# Altium schematic sheet CH565W-R0-1v1.SchDoc
size A1
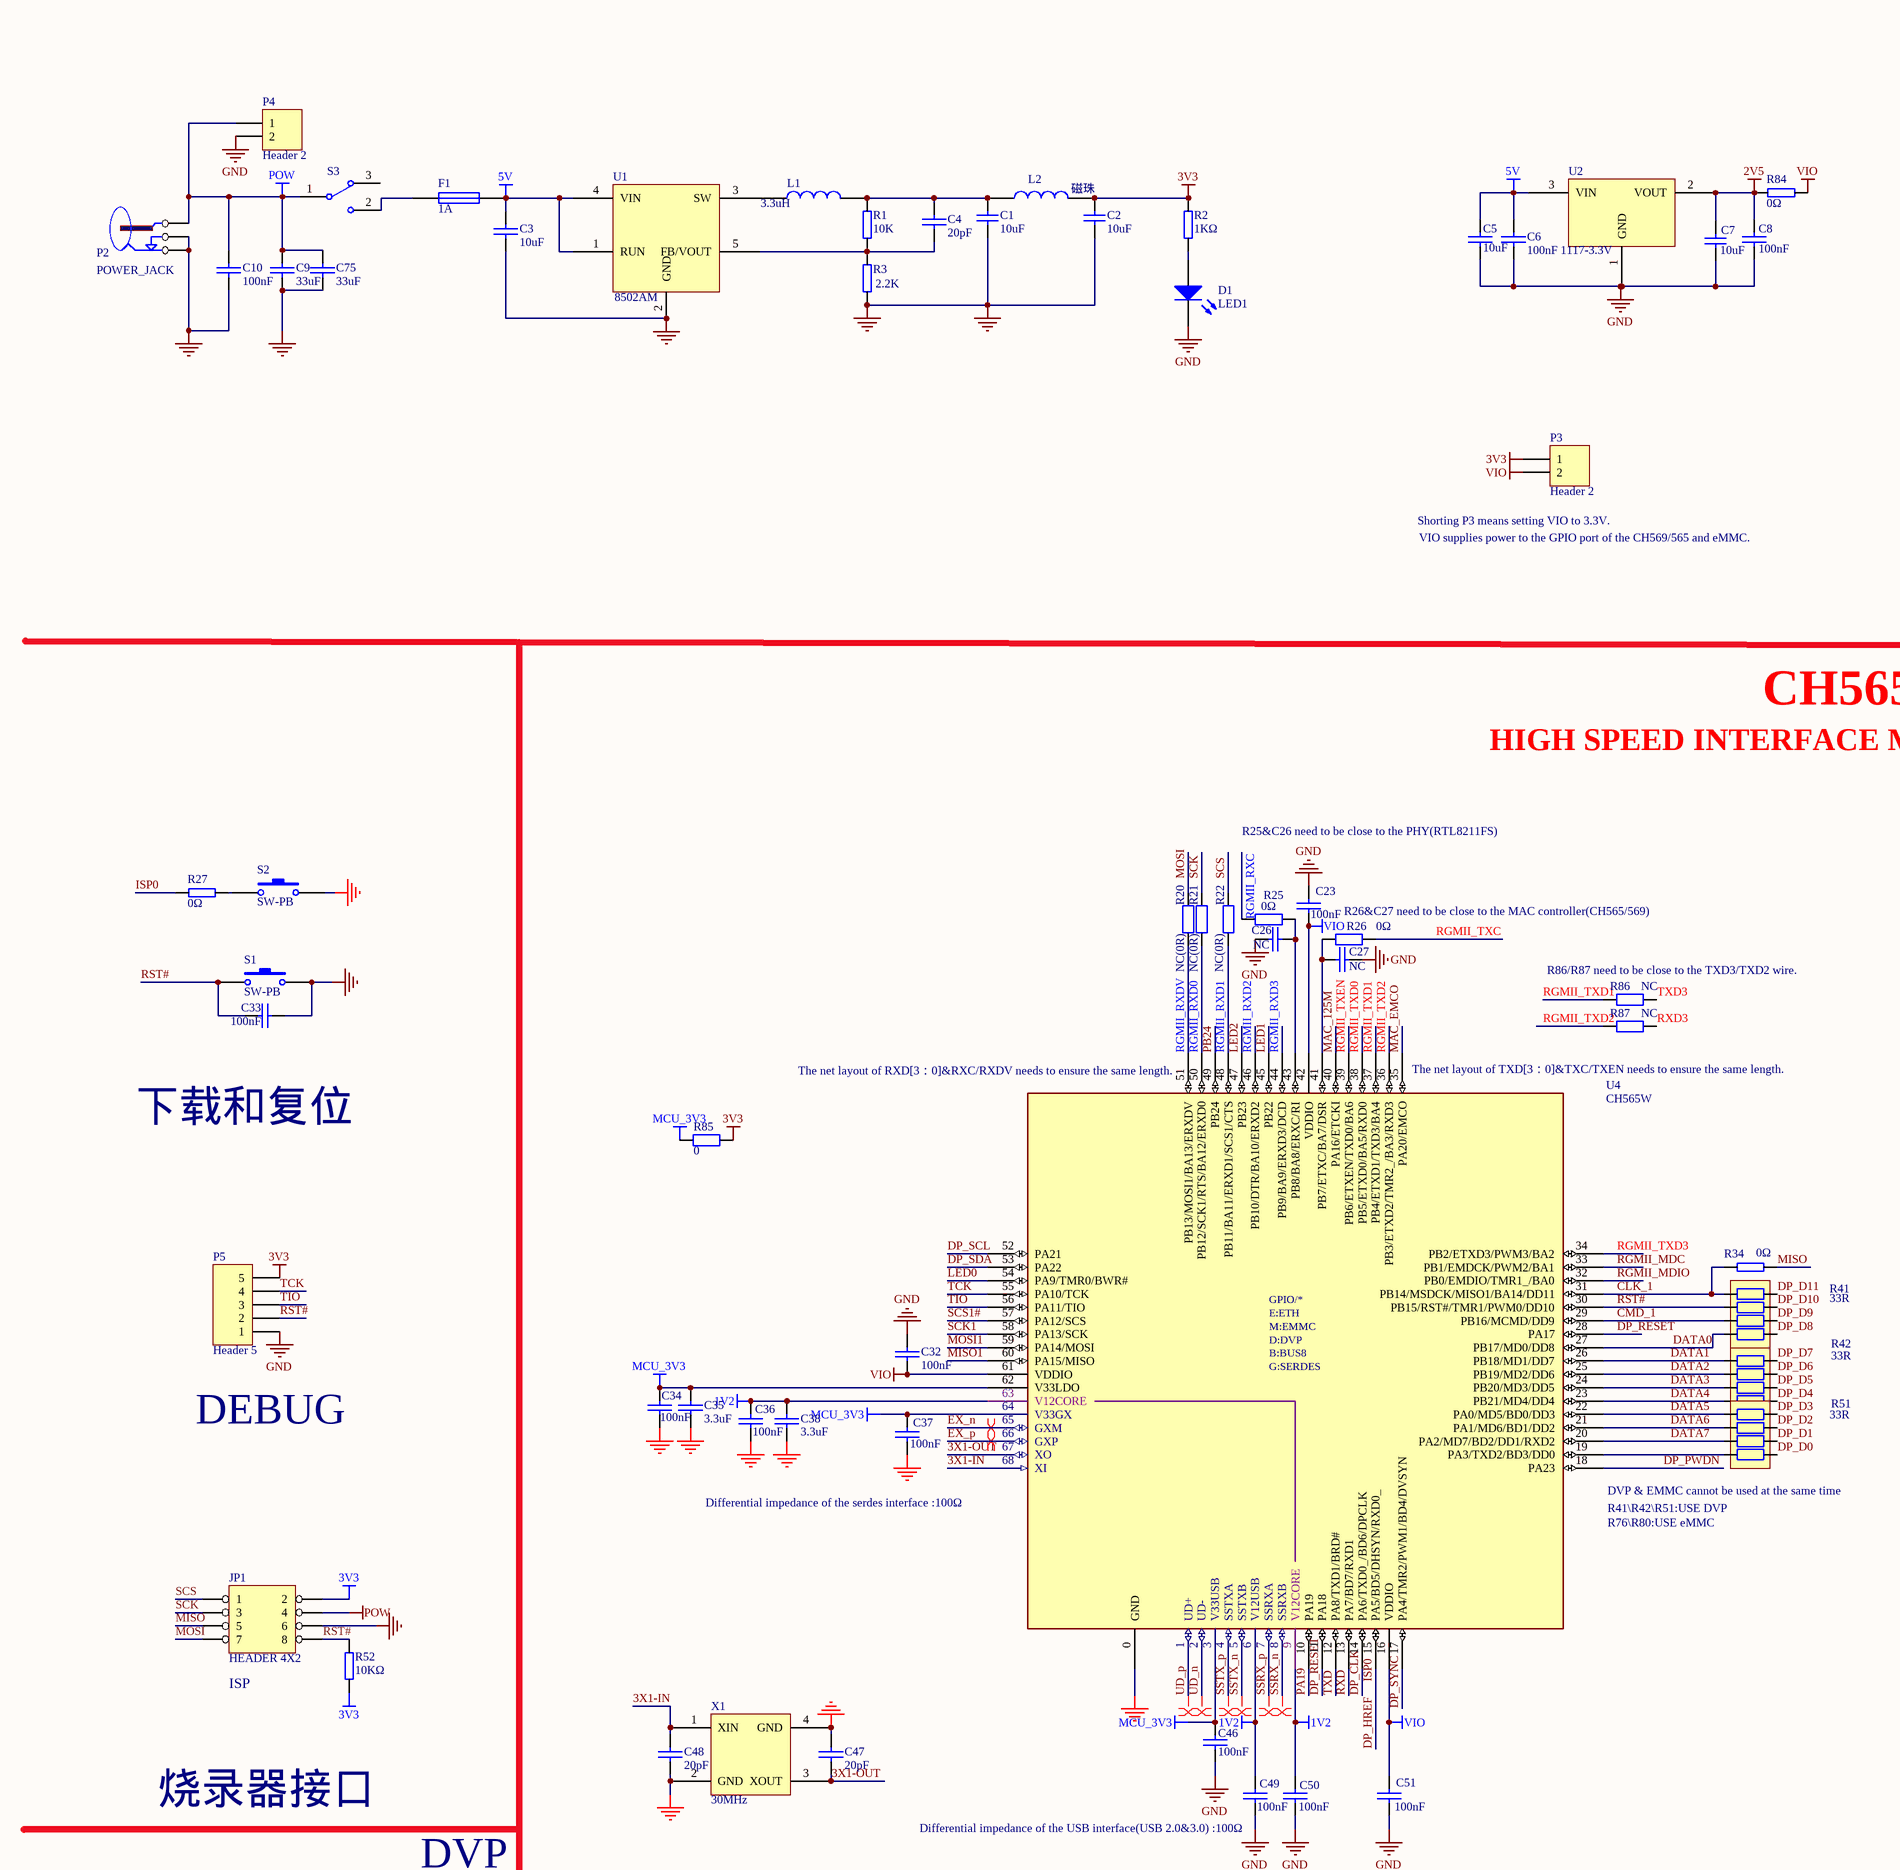
[diagram p0: CH565W-R0-1v1.SchDoc, top left]
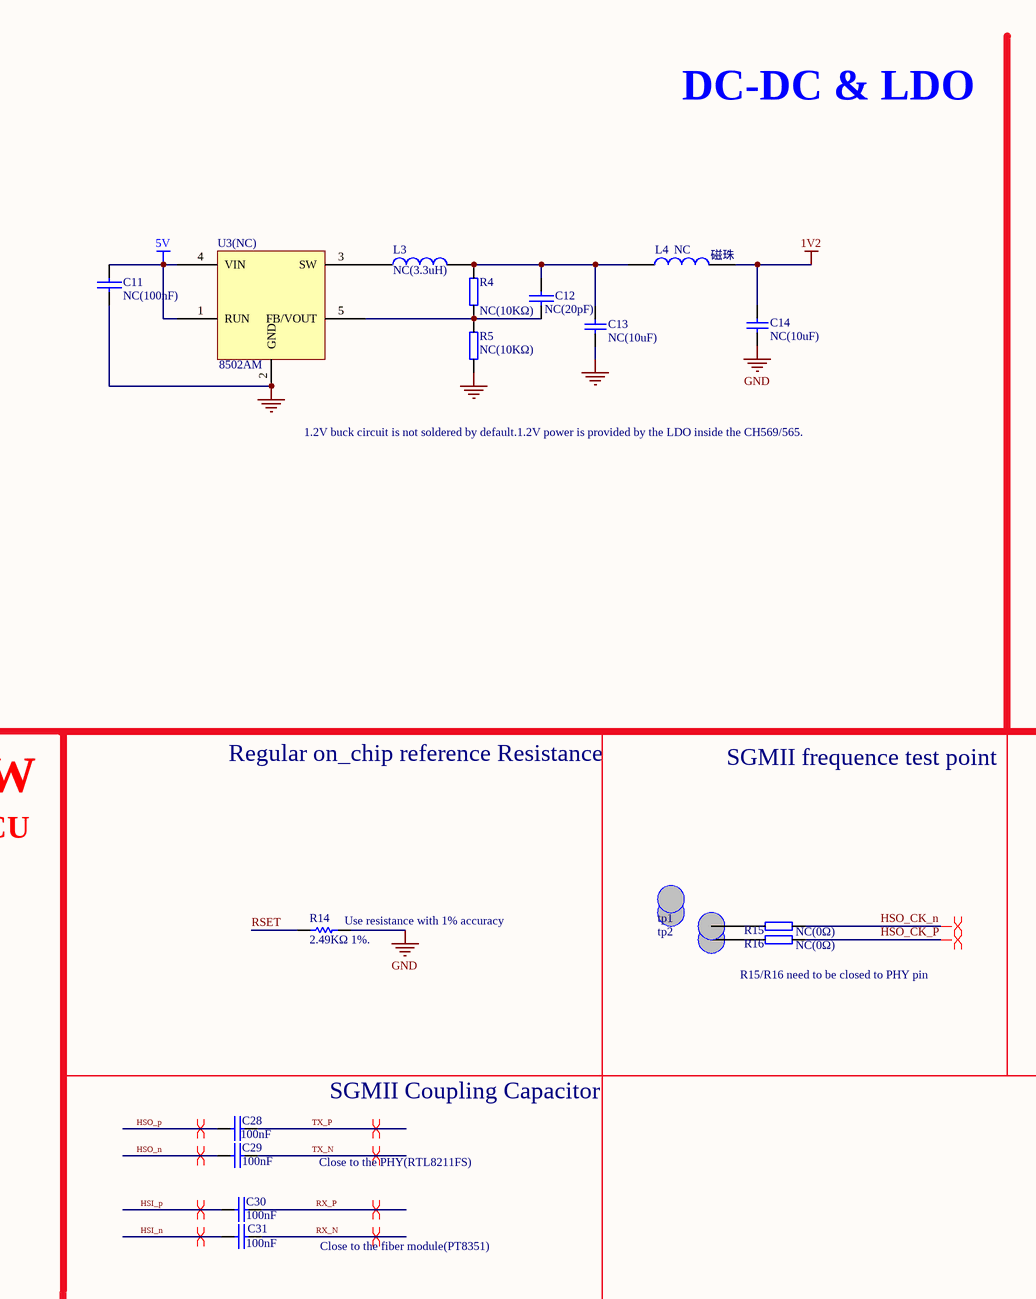
[diagram p1: CH565W-R0-1v1.SchDoc, top middle]
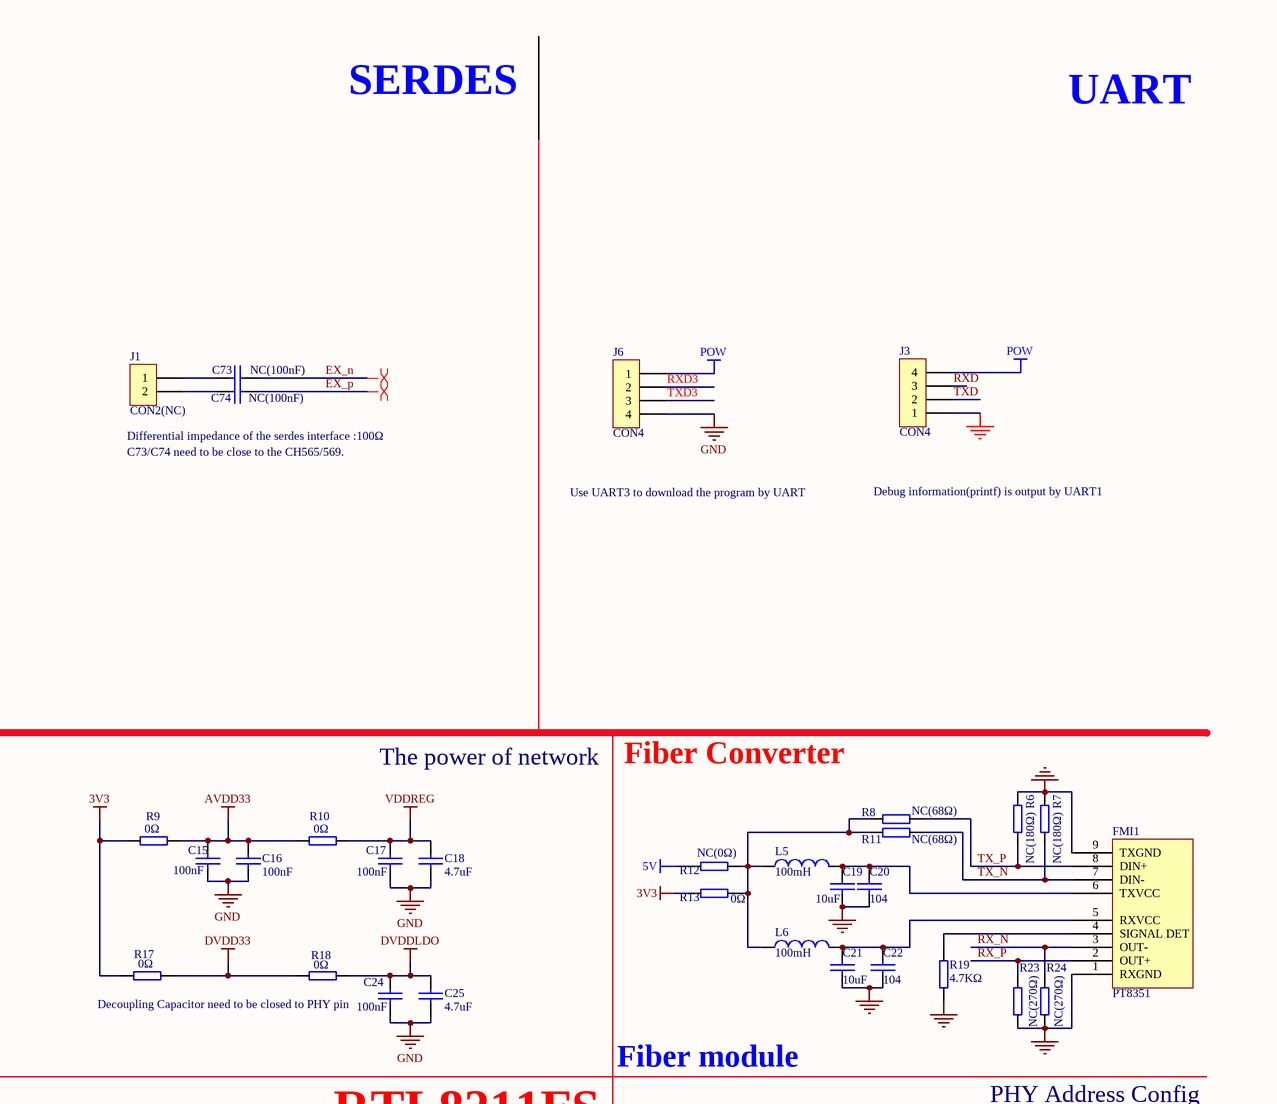
[diagram p2: CH565W-R0-1v1.SchDoc, top right]
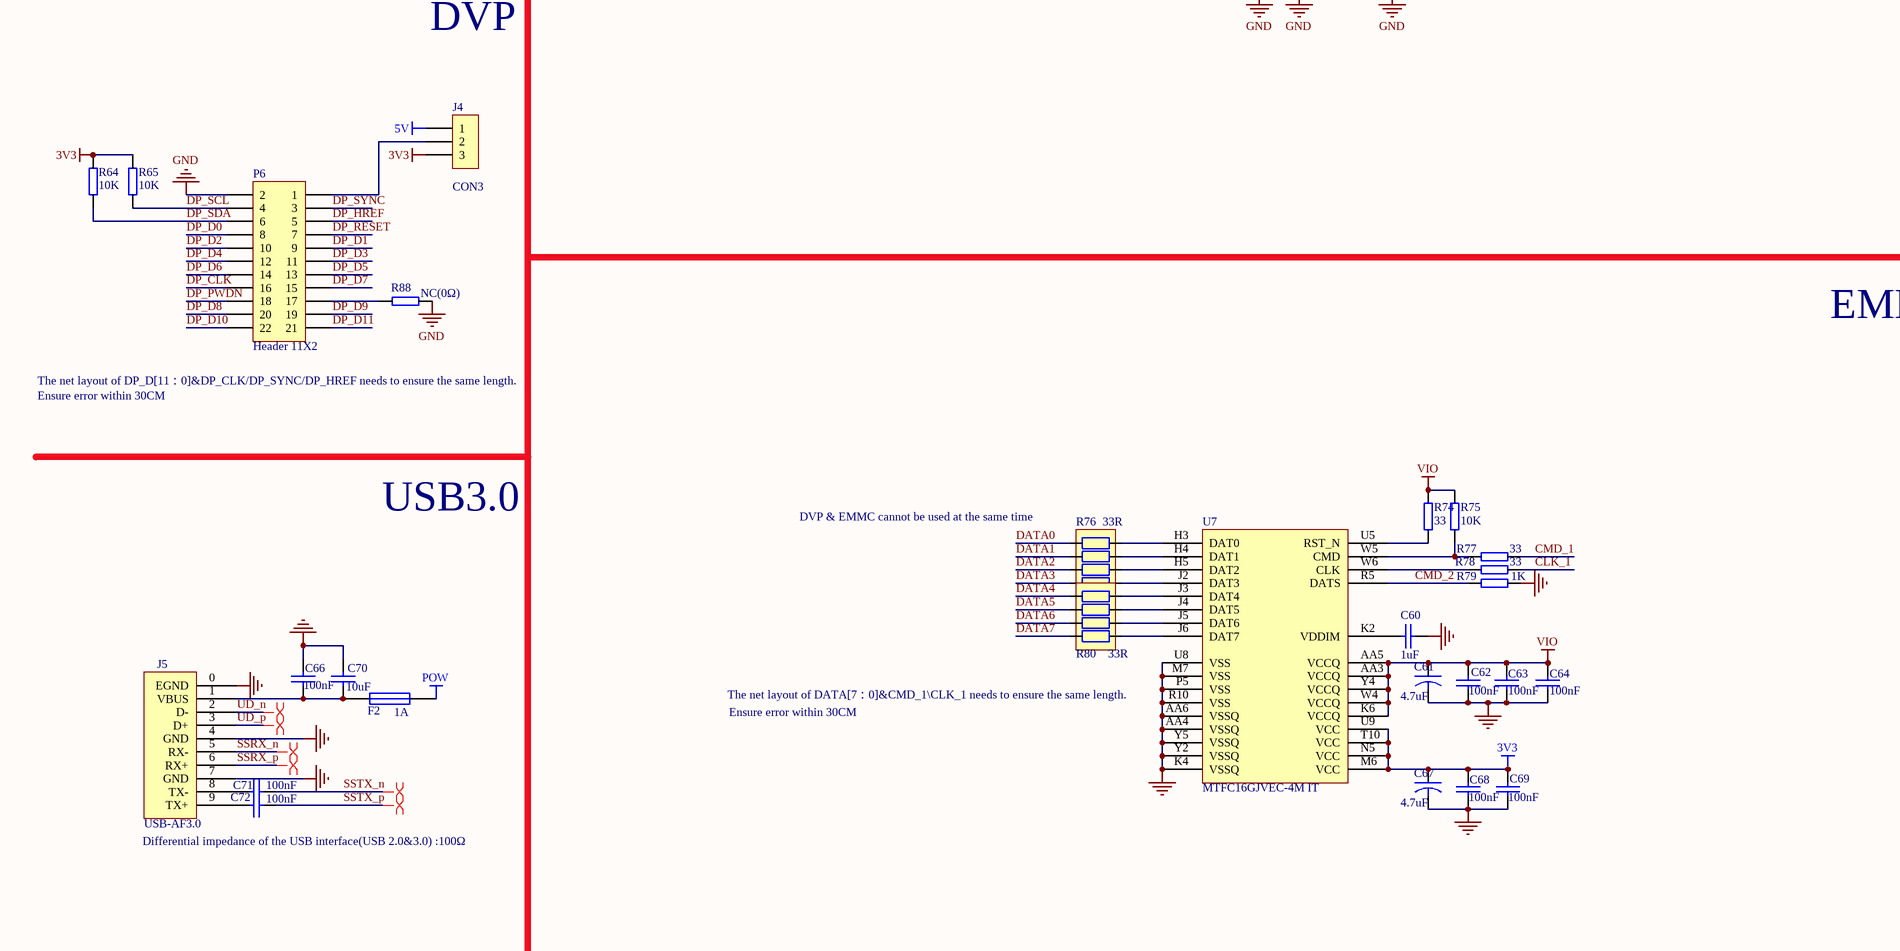
[diagram p3: CH565W-R0-1v1.SchDoc, bottom left]
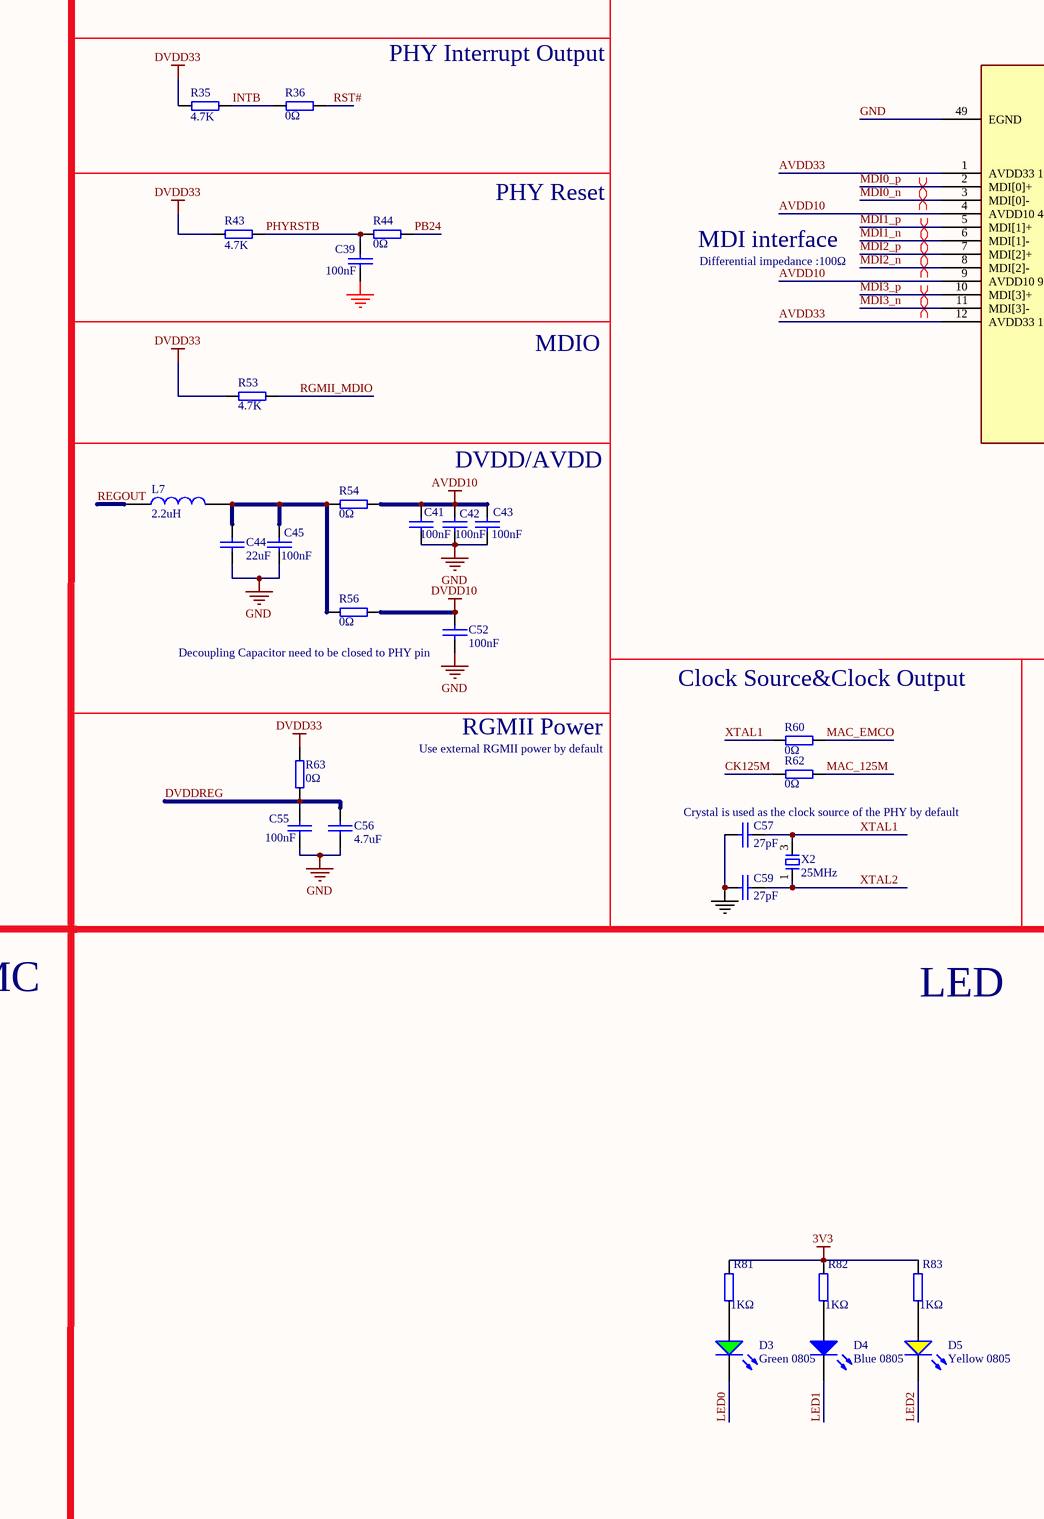
[diagram p4: CH565W-R0-1v1.SchDoc, bottom middle]
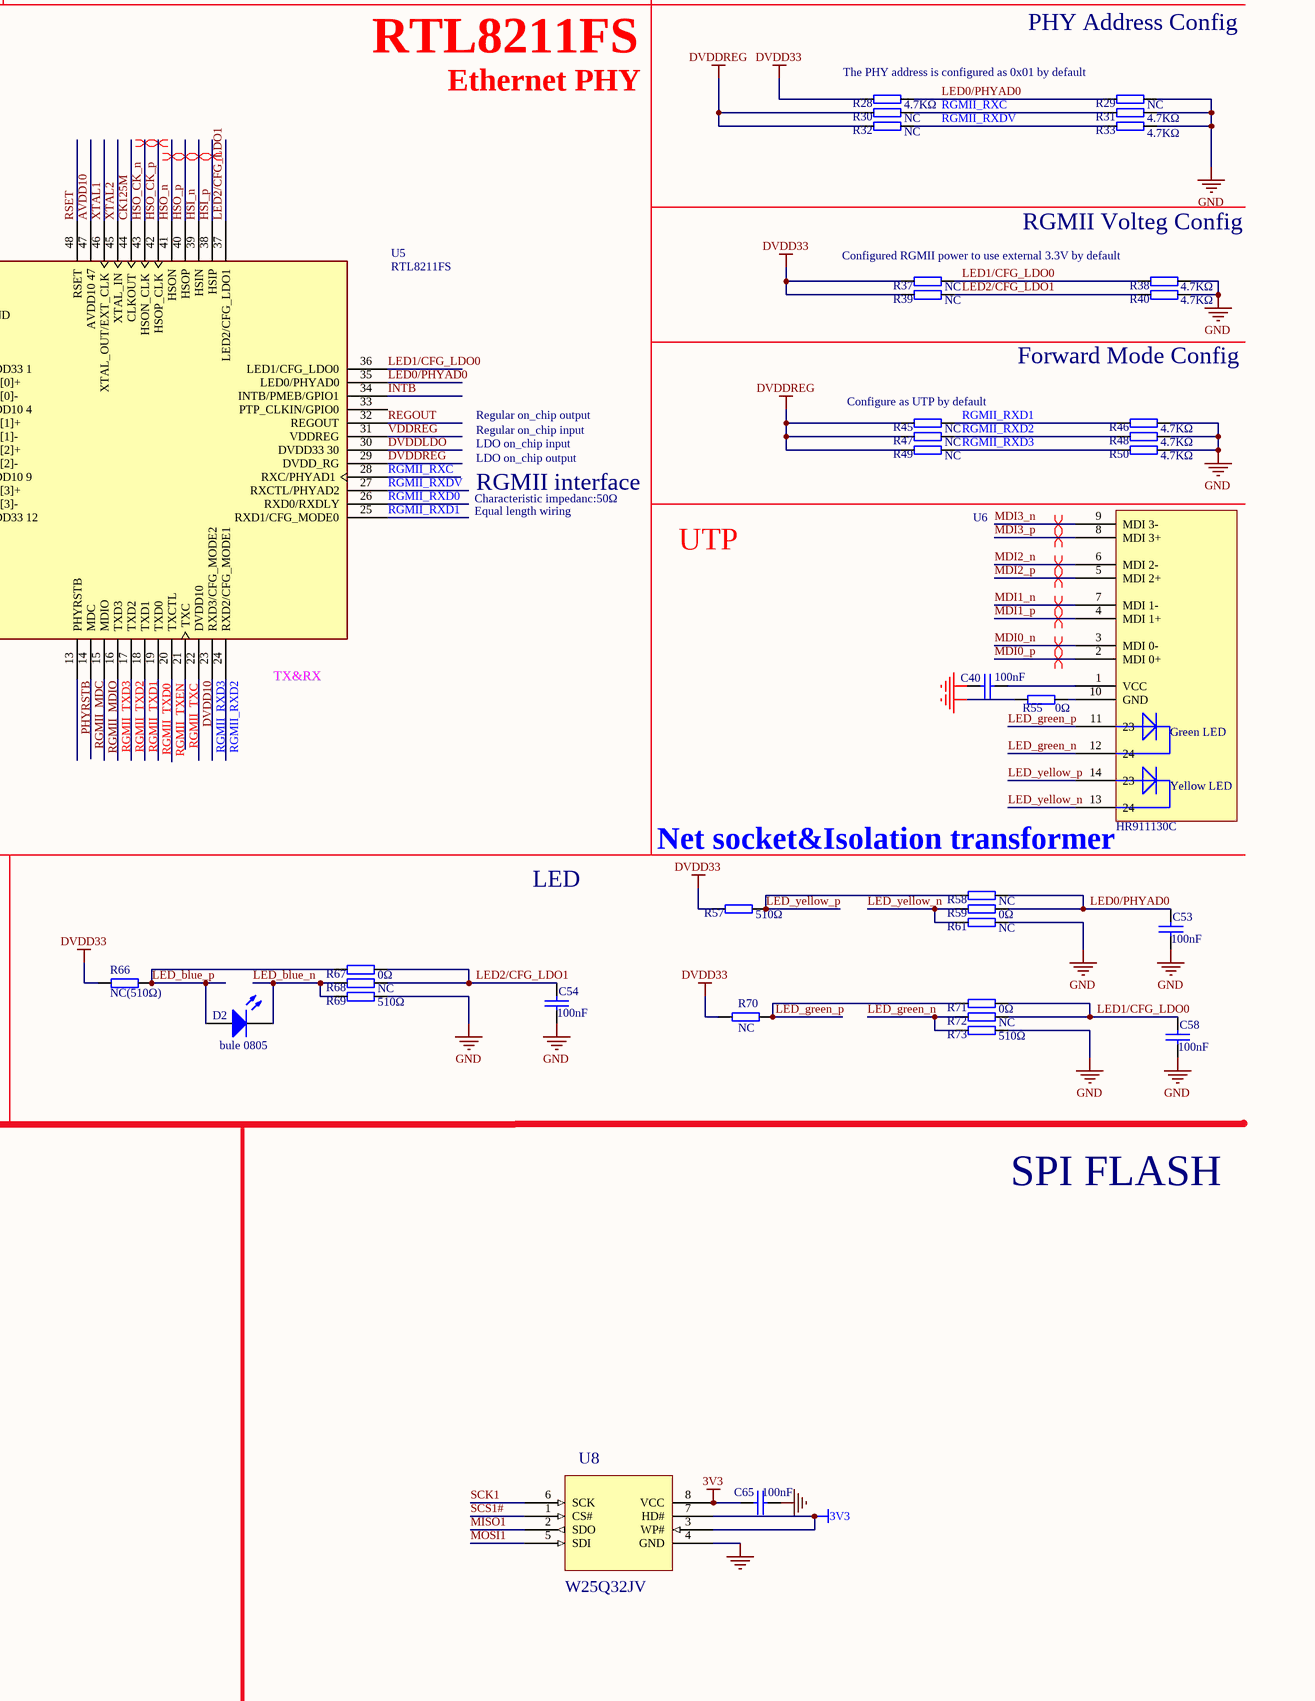
[diagram p5: CH565W-R0-1v1.SchDoc, bottom right]

## Parts
C1  10uF  [3216]
C2  10uF  [3216]
C3  10uF  [3216]
C4  20pF  [0603C]
C5  10uF  [3216]
C6  100nF  [0603C]
C7  10uF  [3216]
C8  100nF  [0603C]
C9  33uF  [3216]
C10  100nF  [0603C]
C11  NC(100nF)  [3216]
C12  NC(20pF)  [0603C]
C13  NC(10uF)  [3216]
C14  NC(10uF)  [3216]
C15  100nF  [0603C]
C16  100nF  [0603C]
C17  100nF  [0603C]
C18  4.7uF  [0603C]
C19  10uF  [3216]
C20  104  [0603C]
C21  10uF  [3216]
C22  104  [0603C]
C23  100nF  [0402C]
C24  100nF  [0603C]
C25  4.7uF  [0603C]
C26  NC  [0402C]
C27  NC  [0402C]
C28  100nF  [C 0402_L]
C29  100nF  [C 0402_L]
C30  100nF  [C 0402_L]
C31  100nF  [C 0402_L]
C32  100nF  [0603C]
C33  100nF  [0603C]
C34  100nF  [0603C]
C35  3.3uF  [0603C]
C36  100nF  [0603C]
C37  100nF  [0603C]
C38  3.3uF  [0603C]
C39  100nF  [0603C]
C40  100nF  [0603C]
C41  100nF  [0603C]
C42  100nF  [0603C]
C43  100nF  [0603C]
C44  22uF  [3528]
C45  100nF  [0603C]
C46  100nF  [0603C]
C47  20pF  [0603C]
C48  20pF  [0603C]
C49  100nF  [0603C]
C50  100nF  [0603C]
C51  100nF  [0603C]
C52  100nF  [0603C]
C53  100nF  [0603C]
C54  100nF  [0603C]
C55  100nF  [0603C]
C56  4.7uF  [0603C]
C57  27pF  [0603C]
C58  100nF  [0603C]
C59  27pF  [0603C]
C60  1uF  [0402C]
C61  4.7uF  [0402C]
C62  100nF  [0402C]
C63  100nF  [0402C]
C64  100nF  [0402C]
C65  100nF  [0603C]
C66  100nF  [0603C]
C67  4.7uF  [0402C]
C68  100nF  [0402C]
C69  100nF  [0402C]
C70  10uF  [3216]
C71  100nF  [C 0402_L]
C72  100nF  [C 0402_L]
C73  NC(100nF)  [0603C]
C74  NC(100nF)  [0603C]
C75  33uF  [3216]
D1  LED1  [0805+]
D2  bule 0805  [0805+]
D3  Green 0805  [0805+]
D4  Blue 0805  [0805+]
D5  Yellow 0805  [0805+]
F1  1A  [0805]
F2  1A  [0805]
FMI1  PT8351  [PT8351]
J1  CON2(NC)  [SIP2-2.54mm]
J3  CON4  [SIP4-2.54mm]
J4  CON3  [SIP3-2.54MM]
J5  USB-AF3.0  [USB3.0-A-Receptacle]
J6  CON4  [SIP4-2.54mm]
JP1  HEADER 4X2  [IDC8-2.54mm]
L1  感值: 3.3uH  [SMD_5x5mm]  (hidden comment: *)
L2  1uH  [0805]  (value not drawn)
L3  NC(3.3uH)  [SMD_5x5mm]
L4  nc(1uH)  [0805]  (value not drawn)
L5  100mH  [0805]
L6  100mH  [0805]
L7  2.2uH  [SMD_5x5mm]
P2  POWER_JACK  [DC-005]
P3  Header 2  [SIP2-2.54mm]
P4  Header 2  [SIP2-2.54mm]
P5  Header 5  [SIP5-2.54mm]
P6  Header 11X2  [IDC22-2.54mm]
R1  10K  [0603]
R2  1KΩ  [0603]
R3  2.2K  [0603]
R4  NC(10KΩ)  [0603]
R5  NC(10KΩ)  [0603]
R6  NC(180Ω)  [0603]
R7  NC(180Ω)  [0603]
R8  NC(68Ω)  [0603]
R9  0Ω  [0603]
R10  0Ω  [0603]
R11  NC(68Ω)  [0603]
R12  NC(0Ω)  [0603]
R13  0Ω  [0603]
R14  2.49KΩ 1%.  [0603]
R15  NC(0Ω)  [0603]
R16  NC(0Ω)  [0603]
R17  0Ω  [0603]
R18  0Ω  [0603]
R19  4.7KΩ  [0603]
R20  NC(0R)  [0402]
R21  NC(0R)  [0402]
R22  NC(0R)  [0402]
R23  NC(270Ω)  [0603]
R24  NC(270Ω)  [0603]
R25  0Ω  [0402]
R26  0Ω  [0402]
R27  0Ω  [0603]
R28  4.7KΩ  [0603]
R29  NC  [0603]
R30  NC  [0603]
R31  4.7KΩ  [0603]
R32  NC  [0603]
R33  4.7KΩ  [0603]
R34  0Ω  [0603]
R35  4.7K  [0603]
R36  0Ω  [0603]
R37  NC  [0603]
R38  4.7KΩ  [0603]
R39  NC  [0603]
R40  4.7KΩ  [0603]
R41  33R  [RCA-8P4R-0603]
R42  33R  [RCA-8P4R-0603]
R43  4.7K  [0603]
R44  0Ω  [0603]
R45  NC  [0603]
R46  4.7KΩ  [0603]
R47  NC  [0603]
R48  4.7KΩ  [0603]
R49  NC  [0603]
R50  4.7KΩ  [0603]
R51  33R  [RCA-8P4R-0603]
R52  10KΩ  [0603]
R53  4.7K  [0603]
R54  0Ω  [0603]
R55  0Ω  [0603]
R56  0Ω  [0603]
R57  510Ω  [0603]
R58  NC  [0603]
R59  0Ω  [0603]
R60  0Ω  [0603]
R61  NC  [0603]
R62  0Ω  [0603]
R63  0Ω  [0603]
R64  10K  [0603]
R65  10K  [0603]
R66  NC(510Ω)  [0603]
R67  0Ω  [0603]
R68  NC  [0603]
R69  510Ω  [0603]
R70  NC  [0603]
R71  0Ω  [0603]
R72  NC  [0603]
R73  510Ω  [0603]
R74  33  [0402]
R75  10K  [0603]
R76  33R  [RCA-8P4R-0603]
R77  33  [0603]
R78  33  [0603]
R79  1K  [0402]
R80  33R  [RCA-8P4R-0603]
R81  1KΩ  [0603]
R82  1KΩ  [0603]
R83  1KΩ  [0603]
R84  0Ω  [0603]
R85  0  [0603]
R86  NC  [0402]
R87  NC  [0402]
R88  NC(0Ω)  [0603]
S1  SW-PB  [SMD_6.1x3.65x2.5mm-KEY]
S2  SW-PB  [SMD_6.1x3.65x2.5mm-KEY]
S3  SW-SPDT  [Horizontal Slide Switch_8.7x4.4mm-2D]  (value not drawn)
tp1  test-point  [TESTPOINT1]  (value not drawn)
tp2  test-point  [TESTPOINT1]  (value not drawn)
U1  8502AM  [SOT-23-5]
U2  1117-3.3V  [SOT-223]
U3(NC)  8502AM  [SOT-23-5]
U4  CH565W  [QFN68_8X8]
U5  RTL8211FS  [QFN48_6X6]
U6  HR911130C  [HR911130C]
U7  MTFC16GJVEC-4M IT  [WFBGA-169-14x18x0.8mm]
U8  W25Q32JV  [SOIC-8_208mil]
X1  30MHz  [3225]
X2  25MHz  [3225]

## Nets
1V2: C14.2 C36.2 C38.2 C49.2 C50.2 L4.2 U4.6(V12USB) U4.9(V12CORE) U4.63(V12CORE)
2V5: C7.2 C8.2 R84.1 U2.2(VOUT)
3V3: C2.2 C65.2 C67.1 C68.1 C69.1 J4.3 JP1.2 L2.2 P3.1 P5.5 R2.2 R9.1 R13.1 R17.1 R52.2 R64.2 R65.2 R81.2 R82.2 R83.2 R85.1 U7.M6(VCC) U7.N5(VCC) U7.T10(VCC) U7.U9(VCC) U8.3(WP#) U8.7(HD#) U8.8(VCC)
5V: C3.2 C5.2 C6.2 C11.2 F1.2 J4.1 R12.1 U1.1(RUN) U1.4(VIN) U2.3(VIN) U3(NC).1(RUN) U3(NC).4(VIN)
AVDD10: C41.2 C42.2 C43.2 R54.2 U5.4(AVDD10_4) U5.9(AVDD10_9) U5.47(AVDD10_47)
AVDD33: C15.2 C16.2 R9.2 R10.1 U5.1(AVDD33_1) U5.12(AVDD33_12)
DVDD10: C52.2 R56.2 U5.22(DVDD10)
DVDD33: R17.2 R18.1 R28.1 R35.2 R37.1 R39.1 R43.2 R53.1 R57.1 R63.2 R66.1 R70.1
DVDDLDO: C24.2 C25.2 R18.2 U5.30(DVDD33_30)
DVDDREG: C55.2 C56.2 R30.1 R32.1 R45.1 R47.1 R49.1 R63.1 U5.29(DVDD_RG)
GND: C1.1 C2.1 C3.1 C5.1 C6.1 C7.1 C8.1 C9.1 C10.1 C11.1 C13.1 C14.1 C15.1 C16.1 C17.1 C18.1 C19.2 C20.2 C21.2 C22.2 C23.2 C24.1 C25.1 C26.1 C27.2 C32.2 C33.2 C34.2 C35.1 C36.1 C37.1 C38.1 C39.1 C40.2 C41.1 C42.1 C43.1 C44.1 C45.1 C46.1 C47.2 C48.1 C49.1 C50.1 C51.1 C52.1 C53.2 C54.2 C55.1 C56.1 C57.1 C58.2 C59.1 C60.2 C61.2 C62.2 C63.2 C64.2 C65.1 C66.2 C67.2 C68.2 C69.2 C70.2 C75.1 D1.2(K) FMI1.1(RXGND) FMI1.9(TXGND) J3.1 J5.0(EGND) J5.4(GND) J5.7(GND) J6.4 JP1.6 P2.2(G) P2.3(X) P4.2 P5.1 P6.2 R3.1 R5.1 R6.2 R7.2 R14.2 R19.1 R23.1 R24.1 R29.2 R31.2 R33.2 R38.2 R40.2 R46.2 R48.2 R50.2 R55.2 R61.2 R69.2 R73.2 R79.2 R88.1 S1.2 S2.1 U1.2(GND) U2.1(GND) U3(NC).2(GND) U4.0(GND) U5.49(EGND) U7.AA4(VSSQ) U7.AA6(VSSQ) U7.K4(VSSQ) U7.M7(VSS) U7.P5(VSS) U7.R10(VSS) U7.U8(VSS) U7.Y2(VSSQ) U7.Y5(VSSQ) U8.4(GND) X1.2(GND) X1.4(GND)
MCU_3V3: C34.1 C35.2 C37.2 C46.2 R85.2 U4.3(V33USB) U4.62(V33LDO) U4.64(V33GX)
POW: C9.2 C10.2 C75.2 F2.2 J3.4 J6.1 JP1.4 P2.1(V) P4.1 S3.1
VDDREG: C17.2 C18.2 R10.2 U5.31(VDDREG)
VIO: C23.1 C32.1 C51.2 C61.1 C62.1 C63.1 C64.1 P3.2 R74.1 R75.1 R84.2 U4.16(VDDIO) U4.42(VDDIO) U4.61(VDDIO) U7.AA3(VCCQ) U7.AA5(VCCQ) U7.K6(VCCQ) U7.W4(VCCQ) U7.Y4(VCCQ)
3X1-IN: C48.2 U4.68(XI) X1.1(XIN)
3X1-OUT: C47.1 U4.67(XO) X1.3(XOUT)
CK125M: R62.1 U5.44(CLKOUT)
CLK_1: R34.1 R41.8 R78.2 U4.31(PB14/MSDCK/MISO1/BA14/DD11)
CMD_1: R41.6 R77.2 U4.29(PB16/MCMD/DD9)
CMD_2: R79.1 U7.R5(DATS)
DATA0: R41.5 R76.1 U4.27(PB17/MD0/DD8)
DATA1: R42.4 R76.2 U4.26(PB18/MD1/DD7)
DATA2: R42.3 R76.3 U4.25(PB19/MD2/DD6)
DATA3: R42.2 R76.4 U4.24(PB20/MD3/DD5)
DATA4: R42.1 R80.1 U4.23(PB21/MD4/DD4)
DATA5: R51.4 R80.2 U4.22(PA0/MD5/BD0/DD3)
DATA6: R51.3 R80.3 U4.21(PA1/MD6/BD1/DD2)
DATA7: R51.2 R80.4 U4.20(PA2/MD7/BD2/DD1/RXD2)
DP_CLK: P6.16 U4.14(PA6/TXD0_/BD6/DPCLK)
DP_D0: P6.8 R51.8
DP_D1: P6.9 R51.7
DP_D2: P6.10 R51.6
DP_D3: P6.11 R51.5
DP_D4: P6.12 R42.8
DP_D5: P6.13 R42.7
DP_D6: P6.14 R42.6
DP_D7: P6.15 R42.5
DP_D8: P6.20 R41.4
DP_D9: P6.19 R41.3
DP_D10: P6.22 R41.2
DP_D11: P6.21 R41.1
DP_HREF: P6.5 R27.1 U4.15(PA5/BD5/DHSYN/RXD0_)  [also labelled ISP0]
DP_PWDN: P6.18 U4.18(PA23)
DP_RESET: P6.7 U4.11(PA18) U4.28(PA17)
DP_SCL: P6.4 R65.1 U4.52(PA21)
DP_SDA: P6.6 R64.1 U4.53(PA22)
DP_SYNC: P6.3 U4.17(PA4/TMR2/PWM1/BD4/DVSYN)
EX_n: C73.1 U4.65(GXM)
EX_p: C74.1 U4.66(GXP)
HSI_n: C31.1 U5.39(HSIN)
HSI_p: C30.1 U5.38(HSIP)
HSO_CK_n: R15.2 U5.43(HSON_CLK)
HSO_CK_p: R16.2 U5.42(HSOP_CLK)
HSO_n: C29.1 U5.41(HSON)
HSO_p: C28.1 U5.40(HSOP)
INTB: R35.1 R36.1 U5.34(INTB/PMEB/GPIO1)
LED0: D3.2(K) U4.54(PA9/TMR0/BWR#)
LED0/PHYAD0: C53.1 R28.2 R29.1 R58.2 R59.2 U5.35(LED0/PHYAD0)
LED1: D4.2(K) U4.45(PB22)
LED1/CFG_LDO0: C58.1 R37.2 R38.1 R71.2 R72.2 U5.36(LED1/CFG_LDO0)
LED2: D5.2(K) U4.47(PB23)
LED2/CFG_LDO1: C54.1 R39.2 R40.1 R67.2 R68.2 U5.37(LED2/CFG_LDO1)
LED_blue_n: D2.2(K) R68.1 R69.1
LED_blue_p: D2.1(A) R66.2 R67.1
LED_green_n: R72.1 R73.1 U6.12(24)
LED_green_p: R70.2 R71.1 U6.11(23)
LED_yellow_n: R59.1 R61.1 U6.13(24)
LED_yellow_p: R57.2 R58.1 U6.14(23)
MAC_125M: R62.2 U4.40(PA16/ETCKI)
MAC_EMCO: R60.2 U4.35(PA20/EMCO)
MDI0_n: U5.3(MDI[0]-) U6.3(MDI_0-)
MDI0_p: U5.2(MDI[0]+) U6.2(MDI_0+)
MDI1_n: U5.6(MDI[1]-) U6.7(MDI_1-)
MDI1_p: U5.5(MDI[1]+) U6.4(MDI_1+)
MDI2_n: U5.8(MDI[2]-) U6.6(MDI_2-)
MDI2_p: U5.7(MDI[2]+) U6.5(MDI_2+)
MDI3_n: U5.11(MDI[3]-) U6.9(MDI_3-)
MDI3_p: U5.10(MDI[3]+) U6.8(MDI_3+)
MISO: JP1.5 R34.2
MISO1: U4.60(PA15/MISO) U8.2(SDO)
MOSI: JP1.7 R20.2
MOSI1: U4.59(PA14/MOSI) U8.5(SDI)
PA19: U4.10(PA19)
PB24: R44.2 U4.49(PB24)
PHYRSTB: C39.2 R43.1 R44.1 U5.13(PHYRSTB)
REGOUT: L7.1 U5.32(REGOUT)
RGMII_MDC: U4.33(PB1/EMDCK/PWM2/BA1) U5.14(MDC)
RGMII_MDIO: R53.2 U4.32(PB0/EMDIO/TMR1_/BA0) U5.15(MDIO)
RGMII_RXC: R25.2 R30.2 R31.1 U5.28(RXC/PHYAD1)
RGMII_RXD0: R21.1 U4.50(PB12/SCK1/RTS/BA12/ERXD0) U5.26(RXD0/RXDLY)
RGMII_RXD1: R22.1 R45.2 R46.1 U4.48(PB11/BA11/ERXD1/SCS1/CTS) U5.25(RXD1/CFG_MODE0)
RGMII_RXD2: R47.2 R48.1 U4.46(PB10/DTR/BA10/ERXD2) U5.24(RXD2/CFG_MODE1)
RGMII_RXD3: R49.2 R50.1 U4.44(PB9/BA9/ERXD3/DCD) U5.23(RXD3/CFG_MODE2)
RGMII_RXDV: R20.1 R32.2 R33.1 U4.51(PB13/MOSI1/BA13/ERXDV) U5.27(RXCTL/PHYAD2)
RGMII_TXC: R26.1 U5.21(TXC)
RGMII_TXD0: U4.38(PB5/ETXD0/BA5/RXD0) U5.19(TXD0)
RGMII_TXD1: R86.2 U4.37(PB4/ETXD1/TXD3/BA4) U5.18(TXD1)
RGMII_TXD2: R87.2 U4.36(PB3/ETXD2/TMR2_/BA3/RXD3) U5.17(TXD2)
RGMII_TXD3: U4.34(PB2/ETXD3/PWM3/BA2) U5.16(TXD3)
RGMII_TXEN: U4.39(PB6/ETXEN/TXD0/BA6) U5.20(TXCTL)
RSET: R14.1 U5.48(RSET)
RST#: C33.1 JP1.8 P5.2 R36.2 R41.7 R52.1 S1.1 U4.30(PB15/RST#/TMR1/PWM0/DD10)
RX_N: C31.2 FMI1.3(OUT-) R24.2
RX_P: C30.2 FMI1.2(OUT+) R23.2
RXD: J3.3 U4.13(PA7/BD7/RXD1)
RXD3: J6.2 R87.1
SCK: JP1.3 R21.2
SCK1: U4.58(PA13/SCK) U8.6(SCK)
SCS: JP1.1 R22.2
SCS1#: U4.57(PA12/SCS) U8.1(CS#)
SSRX_n: J5.5(RX-) U4.8(SSRXB)
SSRX_p: J5.6(RX+) U4.7(SSRXA)
SSTX_n: C71.1 U4.5(SSTXB)
SSTX_p: C72.1 U4.4(SSTXA)
TCK: P5.4 U4.55(PA10/TCK)
TIO: P5.3 U4.56(PA11/TIO)
TX_N: C29.2 FMI1.7(DIN-) R7.1 R11.1
TX_P: C28.2 FMI1.8(DIN+) R6.1 R8.1
TXD: J3.2 U4.12(PA8/TXD1/BRD#)
TXD3: J6.3 R86.1
UD_n: J5.2(D-) U4.2(UD-)
UD_p: J5.3(D+) U4.1(UD+)
XTAL1: C57.2 R60.1 U5.46(XTAL_OUT/EXT_CLK) X2.3
XTAL2: C59.2 U5.45(XTAL_IN) X2.1
NetC1_2: C1.2 C4.2 L1.2 L2.1 R1.1
NetC4_1: C4.1 R1.2 R3.2 U1.5(FB/VOUT)
NetC12_1: C12.1 R4.2 R5.2 U3(NC).5(FB/VOUT)
NetC12_2: C12.2 C13.2 L3.2 L4.1 R4.1
NetC19_1: C19.1 C20.1 FMI1.6(TXVCC) L5.2
NetC21_1: C21.1 C22.1 FMI1.5(RXVCC) L6.2
NetC26_2: C26.2 R25.1 U4.43(PB8/BA8/ERXC/RI)
NetC27_1: C27.1 R26.2 U4.41(PB7/ETXC/BA7/DSR)
NetC40_1: C40.1 U6.1(VCC)
NetC44_2: C44.2 C45.2 L7.2 R54.1 R56.1
NetC60_1: C60.1 U7.K2(VDDIM)
NetC66_1: C66.1 C70.1 F2.1 J5.1(VBUS)
NetC71_2: C71.2 J5.8(TX-)
NetC72_2: C72.2 J5.9(TX+)
NetC73_2: C73.2 J1.1
NetC74_2: C74.2 J1.2
NetD1_1: D1.1(A) R2.1
NetD3_1: D3.1(A) R81.1
NetD4_1: D4.1(A) R82.1
NetD5_1: D5.1(A) R83.1
NetF1_1: F1.1 S3.2
NetFMI1_4: FMI1.4(SIGNAL_DET) R19.2
NetJ4_2: J4.2 P6.1
NetL1_1: L1.1 U1.3(SW)
NetL3_1: L3.1 U3(NC).3(SW)
NetL5_1: L5.1 L6.1 R8.2 R11.2 R12.2 R13.2
NetP6_17: P6.17 R88.2
NetR15_1: R15.1 tp1.1(point)
NetR16_1: R16.1 tp2.1(point)
NetR27_2: R27.2 S2.2
NetR51_1: R51.1 U4.19(PA3/TXD2/BD3/DD0)
NetR55_1: R55.1 U6.10(GND)
NetR74_2: R74.2 U7.U5(RST_N)
NetR75_2: R75.2 R77.1 U7.W5(CMD)
NetR76_5: R76.5 U7.J2(DAT3)
NetR76_6: R76.6 U7.H5(DAT2)
NetR76_7: R76.7 U7.H4(DAT1)
NetR76_8: R76.8 U7.H3(DAT0)
NetR78_1: R78.1 U7.W6(CLK)
NetR80_5: R80.5 U7.J6(DAT7)
NetR80_6: R80.6 U7.J5(DAT6)
NetR80_7: R80.7 U7.J4(DAT5)
NetR80_8: R80.8 U7.J3(DAT4)

Not connected (* = marked no-connect by the designer): S3 3; U5 33(PTP_CLKIN/GPIO0)

## Layout directives
differential pair: EX_n, EX_p, HSI_n, HSI_p, HSO_CK_n, HSO_CK_p, HSO_n, HSO_p, MDI0_n, MDI0_p, MDI1_n, MDI1_p, MDI2_n, MDI2_p, MDI3_n, MDI3_p, RX_N, RX_P, SSRX_n, SSRX_p, SSTX_n, SSTX_p, TX_N, TX_P, UD_n, UD_p

## Notes on the sheet
- DC-DC & LDO
- SERDES
- UART
- 1.2V buck circuit is not soldered by default.1.2V power is provided by the LDO inside the CH569/565.
- Differential impedance of the serdes interface :100Ω
- C73/C74 need to be close to the CH565/569.
- Use UART3 to download the program by UART
- Debug information(printf) is output by UART1
- (near P3) Shorting P3 means setting VIO to 3.3V.
- VIO supplies power to the GPIO port of the CH569/565 and eMMC.
- CH565W
- Regular on_chip reference Resistance
- SGMII frequence test point
- The power of network
- Fiber Converter
- HIGH SPEED INTERFACE MCU
- R25&C26 need to be close to the PHY(RTL8211FS)
- (near R14) Use resistance with 1% accuracy
- (near R26) R26&C27 need to be close to the MAC controller(CH565/569)
- R15/R16 need to be closed to PHY pin
- (near C24) Decoupling Capacitor need to be closed to PHY pin
- (near R86) R86/R87 need to be close to the TXD3/TXD2 wire.
- Fiber module
- SGMII Coupling Capacitor
- RTL8211FS
- PHY Address Config
- (near U4) The net layout of RXD[3：0]&RXC/RXDV needs to ensure the same length.
- (near U4) The net layout of TXD[3：0]&TXC/TXEN needs to ensure the same length.
- Close to the PHY(RTL8211FS)
- Ethernet PHY
- The PHY address is configured as 0x01 by default
- 下载和复位
- Close to the fiber module(PT8351)
- PHY Interrupt Output
- Configured RGMII power to use external 3.3V by default
- RGMII Volteg Config
- PHY Reset
- (near R45) Configure as UTP by default
- Forward Mode Config
- DEBUG
- MDI interface
- Differential impedance :100Ω
- Regular on_chip output
- Regular on_chip input
- LDO on_chip input
- LDO on_chip output
- (near U4) Differential impedance of the serdes interface :100Ω
- DVP & EMMC cannot be used at the same time
- R41\R42\R51:USE DVP
- Characteristic impedanc:50Ω
- Equal length wiring
- RGMII interface
- (near U4) R76\R80:USE eMMC
- MDIO
- UTP
- DVDD/AVDD
- (near U5) TX&RX
- (near JP1) ISP
- 烧录器接口
- Differential impedance of the USB interface(USB 2.0&3.0) :100Ω
- (near C52) Decoupling Capacitor need to be closed to PHY pin
- (near R60) Clock Source&Clock Output
- (near U6) Net socket&Isolation transformer
- DVP
- Use external RGMII power by default
- RGMII Power
- LED
- (near C57) Crystal is used as the clock source of the PHY by default
- EMMC
- SPI FLASH
- The net layout of DP_D[11：0]&DP_CLK/DP_SYNC/DP_HREF needs to ensure the same length.
- Ensure error within 30CM
- USB3.0
- (near R76) DVP & EMMC cannot be used at the same time
- The net layout of DATA[7：0]&CMD_1\CLK_1 needs to ensure the same length.
- (in symbol CH565W) GPIO/*; E:ETH; M:EMMC; D:DVP; B:BUS8; G:SERDES
- (in symbol HR911130C) Green LED; Yellow LED
- (in symbol INDUCTOR) 磁珠; NC
- (in symbol RTL8211FS(I)) RTL8211FS(I)(-VS)

## Library data of the parts
C1 C2 C7 C13 C14 = cap: Capacitor
C3-C6 C8-C12 C15-C60 C62-C66 C68-C75 = CAP: Capacitor
  C6 C8 C10 C15-C17 C23 C24 C28-C34 C36 C37 C39-C43 C45 C46 C49-C55 C58 C62-C66 C68 C69 C71 C72: 容值: 100nF
  C9 C75: 容值: 33uF
C61 C67 = CAPACITOR
D1 = LED1: Typical RED GaAs LED; PackageDescription: LED; 2 Leads
D2 D4 = 0805 蓝灯: 发光二极管
D3 = 0805 翠绿: 发光二极管
D5 = 0805 黄灯: 发光二极管
F1 F2 = FUSE1: Fuse
  F1: 额定电流: 1A
J1 = CON2: Connector
J3 J6 = CON4: Connector
J4 = CON3: Connector
J5 = USB-AF3.0-90卷
L1-L4 L7 = INDUCTOR
L5 L6 = Inductor
P3 P4 = Header 2: Header, 2-Pin; Publisher: Altium Limited
  P3: LatestRevisionDate: 17-Jul-2002; LatestRevisionNote: Re-released for DXP Platform.
P5 = Header 5: Header, 5-Pin; Publisher: Altium Limited
P6 = Header 11X2: Header, 11-Pin, Dual row; LatestRevisionDate: 17-Jul-2002; LatestRevisionNote: Re-released for DXP Platform.; Publisher: Altium Limited
R1-R13 R15-R19 R23 R24 R27-R40 R43-R50 R52-R73 R81-R84 R88 = Res
  R35: 阻值: 4.7K
R14 = Res1: Resistor
R20-R22 R25 R26 R85-R87 = Res2: Resistor; PackageDescription: Axial Device, Thru-Hole; 2 Leads; 0.4 in Pin Spacing
R41 R42 R51 R76 R80 = R-8P4R: 贴片网络排阻
R74 R75 R77-R79 = R
S1 S2 = SW-PB: Switch
S3 = SW-SPDT: SPDT Subminiature Toggle Switch, Right Angle Mounting, Vertical Actuation
tp1 tp2 = test-point: 测试点
U4 = CH565W: 32bit RISC-V MCU with USB 3.0 SS/HS & 4*UART & ETH & DVP
U5 = RTL8211FS(I): 千兆以太网物理层芯片
U8 = Pro89C.tmp_25F512_2
X1 = 晶体
X2 = XTAL-2P: 2脚无源脚晶振; 版权归属: 源创客; BOM名称: 2脚无源脚晶振; 学习资源: www.ooocke.com